# Altium schematic sheet gydrodrive_control.SchDoc
size 297 x 209 mm; SheetNumber: 11; SheetTotal: 22
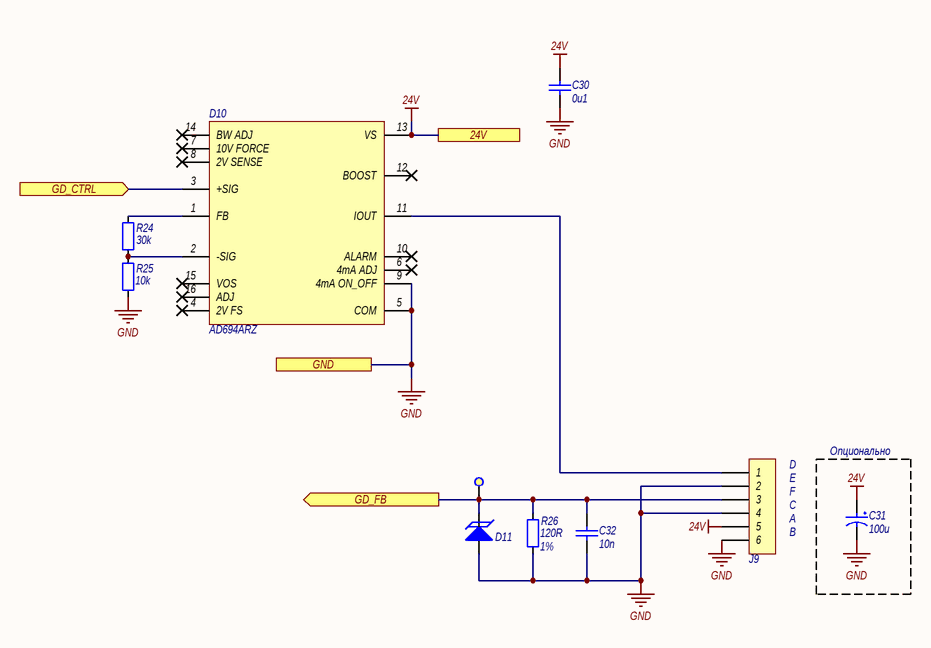
[diagram p0: gydrodrive_control.SchDoc]

## Parts
C30  Capacitance: 0u1  [CAPC2012-0805M]  (hidden comment: CAP_0805)
C31  Capacitance: 100u  [ECAP811.5]  (hidden comment: TKR101M1HF11)
C32  Capacitance: 10n  [CAPC2012-0805M]  (hidden comment: CAP_0805)
D10  AD694ARZ  [SO16W_M]
D11  SMBJ3V3-E3/52  [SMB_M]  (value not drawn)
J9  DG142V-5.08-06P  [DG142V-5.08-06P]  (value not drawn)
R24  Resistance: 30k  [RESC2012-0805M]  (hidden comment: RES_0805)
R25  Resistance: 10k  [RESC2012-0805M]  (hidden comment: RES_0805)
R26  Resistance: 120R  Tolerance: 1%  [RESC2012-0805M]  (hidden comment: RES_0805)
TP8  Test point 1  [TP_1]  (value not drawn)  (no BOM)

## Blocks framed on the sheet
Опционально: C31

## Ports
24V (see gydrodrive_main[4A], gydrodrive_button[2B], gydrodrive_currentSource[2B], gydrodrive_discreteControl[4B], gydrodrive_encoder[3B], gydrodrive_linearPosSensor[3B], gydrodrive_sensor[3B], gydrodrive_sensors[2B], gydrodrive_sto[3B], gydrodrive_supply[2B]), GD_CTRL (in, see gydrodrive_main[3A]), GD_FB (out, see gydrodrive_main[3A]), GND (see gydrodrive_main[4A], gydrodrive_button[2C], gydrodrive_can[3C], gydrodrive_currentSource[2B], gydrodrive_debugger[4C], gydrodrive_discreteControl[3B], gydrodrive_encoder[1B], gydrodrive_i2c[5C], gydrodrive_indication[3C], gydrodrive_inputTrim[2C], gydrodrive_interfaces[3A], gydrodrive_linearPosSensor[2C], gydrodrive_mcu[6D], gydrodrive_reservedPins[2C], gydrodrive_rs485[3B], gydrodrive_sensor[3C], gydrodrive_sensors[2B], gydrodrive_sto[2C], gydrodrive_supply[2C], gydrodrive_uart[4C])

## Nets
24V: C30.2 C31.1 D10.13(VS) J9.5 ; port 24V
GND: C30.1 C31.2 C32.1 D10.5(COM) D10.9(4mA_ON_OFF) D11.2(A) J9.2 J9.4 J9.6 R25.1 R26.1 ; port GND
GD_CTRL: D10.3(+SIG) ; port GD_CTRL
GD_FB: C32.2 D11.1(K) J9.3 R26.2 TP8.1 ; port GD_FB
NetD10_1: D10.1(FB) R24.2
NetD10_2: D10.2(-SIG) R24.1 R25.2
NetD10_11: D10.11(IOUT) J9.1

Not connected (* = marked no-connect by the designer): D10 4(2V_FS)* 6(4mA_ADJ)* 7(10V_FORCE)* 8(2V_SENSE)* 10(ALARM)* 12(BOOST)* 14(BW_ADJ)* 15(VOS)* 16(ADJ)*

## Notes on the sheet
- (near J9) D
- (near J9) E
- F
- C
- A
- B
- Подп. и дата
- Инв. № дубл.
- Взам. инв. №
- Инв. № подл.
- Изм.
- Лист
- № докум.
- Подп.
- Дата
- Копировал
- Формат
- A4

## Library data of the parts
C30 = CAPC_0805: Конденсатор керамический, корпус 0805; Parameters: 0u1,  50V; Voltage: 50V; Max Price: 5; Part Number: CAPC_0805; Part Name: ='Конд-р керам. 0805,  '  + Parameters; Component Type: Standart; Pin Count: 2
C31 = TKR101M1HF11: Конденсатор электролитический; Part Name: Конд-р электрол.  TKR101M1HF11, 100uF, 50V; Parameters: 100uF, 50V; Voltage: 50V; Max Price: 20; Part Number: TKR101M1HF11; Component Type: Standart
C32 = CAPC_0805: Конденсатор керамический, корпус 0805; Parameters: 10n,  50V; Voltage: 50V; Max Price: 5; Part Number: CAPC_0805; Part Name: ='Конд-р керам. 0805,  '  + Parameters; Component Type: Standart; Pin Count: 2
D10 = AD694ARZ: Part Name: Передатчик 4-20mA AD694ARZ; Max Price: 1500; Part Number: AD694ARZ; Component Type: Standart
D11 = SMBJ3V3-E3/52: Защитный диод (TVS); Part Name: Защитный диод SMBJ3V3-E3/52; Parameters: 3V3, 600W; Voltage: 3V3; Max Price: 40; Part Number: SMBJ3V3-E3/52; Component Type: Standart; Pin Count: 0
J9 = DG142V-5.08-06P: Клеммник 6-контактный, шаг 5.08 мм; Part Name: Клеммник DG142V-5.08-06P; Parameters: 8А; Max Price: 60; System: Connector; Part Number: DG142V-5.08-06P; Component Type: Standart; Pin Count: 6
R24 = RESC_0805: Рез-р, корпус 0805; Tolerance: 5%; Parameters: 30k, 5%; Max Price: 3; Part Number: RESC_0805; Part Name: ='Рез-р 0805, ' + Parameters; Component Type: Standart
R25 = RESC_0805: Рез-р, корпус 0805; Tolerance: 5%; Parameters: 10k, 5%; Max Price: 3; Part Number: RESC_0805; Part Name: ='Рез-р 0805, ' + Parameters; Component Type: Standart
R26 = RESC_0805: Рез-р, корпус 0805; Parameters: 120R, 1%; Max Price: 3; Part Number: RESC_0805; Part Name: ='Рез-р 0805, ' + Parameters; Component Type: Standart
TP8 = Test point 1: Тестовый контакт круглый 1 мм; Part Number: Test point 1; Part Name: Тестовый контакт; Component Type: Standart (No BOM)